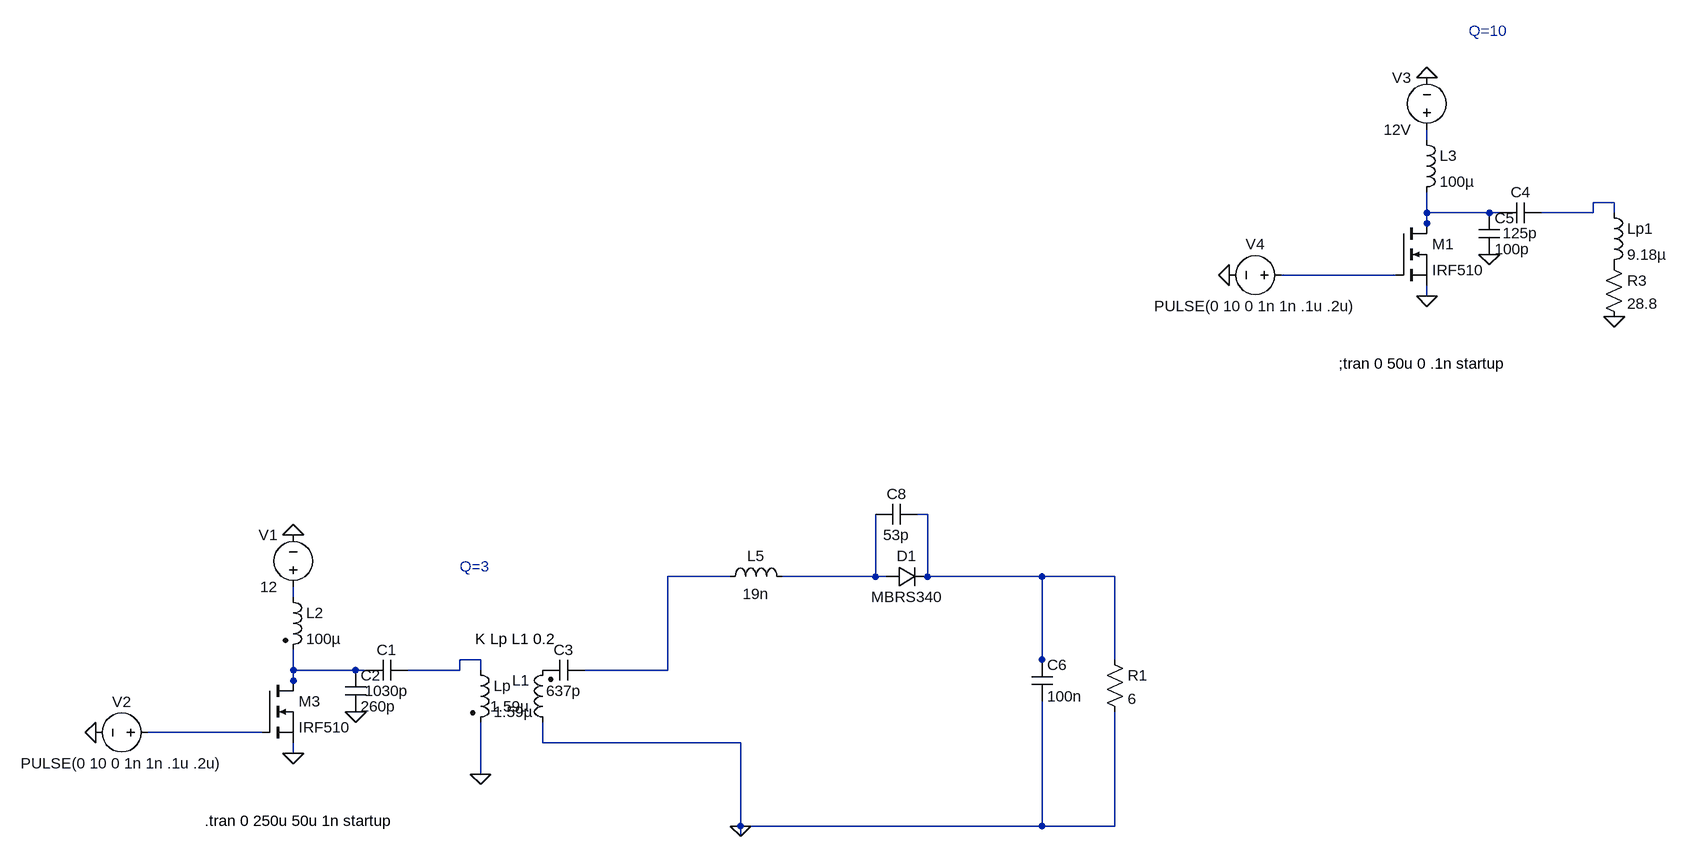
[diagram p0: schematic ClassE.asc]
ClassE.asc, the LTspice schematic file:
Version 4.1
SHEET 1 2296 692
WIRE 1920 -720 1920 -736
WIRE 2208 -624 2176 -624
WIRE 1920 -608 1920 -640
WIRE 2016 -608 1920 -608
WIRE 2032 -608 2016 -608
WIRE 2176 -608 2176 -624
WIRE 2176 -608 2096 -608
WIRE 2208 -608 2208 -624
WIRE 1920 -592 1920 -608
WIRE 1920 -576 1920 -592
WIRE 1872 -512 1696 -512
WIRE 1920 -480 1920 -496
WIRE 1152 -144 1136 -144
WIRE 848 -48 752 -48
WIRE 1072 -48 1072 -144
WIRE 1072 -48 928 -48
WIRE 1088 -48 1072 -48
WIRE 1152 -48 1152 -144
WIRE 1328 -48 1152 -48
WIRE 1440 -48 1328 -48
WIRE 176 -16 176 -32
WIRE 464 80 432 80
WIRE 1328 80 1328 -48
WIRE 1440 80 1440 -48
WIRE 176 96 176 64
WIRE 272 96 176 96
WIRE 288 96 272 96
WIRE 432 96 432 80
WIRE 432 96 352 96
WIRE 464 96 464 80
WIRE 752 96 752 -48
WIRE 752 96 624 96
WIRE 1328 96 1328 80
WIRE 176 112 176 96
WIRE 176 128 176 112
WIRE 128 192 -48 192
WIRE 560 208 560 176
WIRE 864 208 560 208
WIRE 176 224 176 208
WIRE 464 256 464 176
WIRE 864 336 864 208
WIRE 1328 336 1328 144
WIRE 1328 336 864 336
WIRE 1440 336 1440 160
WIRE 1440 336 1328 336
WIRE 864 352 864 336
FLAG -128 192 0
FLAG 272 160 0
FLAG 176 224 0
FLAG 464 256 0
FLAG 1920 -816 0
FLAG 1616 -512 0
FLAG 2016 -544 0
FLAG 1920 -480 0
FLAG 2208 -448 0
FLAG 176 -112 0
FLAG 864 336 0
SYMBOL cap 352 80 R90
WINDOW 0 0 32 VBottom 2
WINDOW 3 32 32 VTop 2
SYMATTR InstName C1
SYMATTR Value 1030p
SYMBOL cap 256 96 R0
SYMATTR InstName C2
SYMATTR Value 260p
SYMBOL ind2 160 -32 R0
SYMATTR InstName L2
SYMATTR Value 100µ
SYMATTR Type ind
SYMBOL voltage 176 -16 R180
WINDOW 0 24 96 Left 2
WINDOW 3 24 16 Left 2
SYMATTR InstName V1
SYMATTR Value 12
SYMBOL voltage -32 192 R90
WINDOW 0 -32 56 VBottom 2
WINDOW 3 32 56 VTop 2
WINDOW 123 0 0 Left 0
WINDOW 39 60 56 VTop 2
SYMATTR InstName V2
SYMATTR Value PULSE(0 10 0 1n 1n .1u .2u)
SYMBOL ind2 448 80 R0
SYMATTR InstName Lp
SYMATTR Value 1.59µ
SYMATTR Type ind
SYMBOL cap 2096 -624 R90
WINDOW 0 0 32 VBottom 2
WINDOW 3 32 32 VTop 2
SYMATTR InstName C4
SYMATTR Value 125p
SYMBOL cap 2000 -608 R0
SYMATTR InstName C5
SYMATTR Value 100p
SYMBOL ind 1904 -736 R0
SYMATTR InstName L3
SYMATTR Value 100µ
SYMBOL voltage 1920 -720 R180
WINDOW 0 24 96 Left 2
WINDOW 3 24 16 Left 2
SYMATTR InstName V3
SYMATTR Value 12V
SYMBOL voltage 1712 -512 R90
WINDOW 0 -32 56 VBottom 2
WINDOW 3 32 56 VTop 2
WINDOW 123 0 0 Left 0
WINDOW 39 60 56 VTop 2
SYMATTR InstName V4
SYMATTR Value PULSE(0 10 0 1n 1n .1u .2u)
SYMBOL ind 2192 -624 R0
SYMATTR InstName Lp1
SYMATTR Value 9.18µ
SYMBOL res 2192 -544 R0
SYMATTR InstName R3
SYMATTR Value 28.8
SYMBOL nmos 128 112 R0
SYMATTR InstName M3
SYMATTR Value IRF510
SYMBOL ind2 576 192 R180
WINDOW 0 36 80 Left 2
WINDOW 3 36 40 Left 2
SYMATTR InstName L1
SYMATTR Value 1.59µ
SYMATTR Type ind
SYMBOL cap 624 80 R90
WINDOW 0 0 32 VBottom 2
WINDOW 3 32 32 VTop 2
SYMATTR InstName C3
SYMATTR Value 637p
SYMBOL nmos 1872 -592 R0
SYMATTR InstName M1
SYMATTR Value IRF510
SYMBOL cap 1312 80 R0
SYMATTR InstName C6
SYMATTR Value 100n
SYMBOL res 1424 64 R0
SYMATTR InstName R1
SYMATTR Value 6
SYMBOL ind 832 -32 R270
WINDOW 0 32 56 VTop 2
WINDOW 3 5 56 VBottom 2
SYMATTR InstName L5
SYMATTR Value 19n
SYMBOL diode 1088 -32 R270
WINDOW 0 32 32 VTop 2
WINDOW 3 0 32 VBottom 2
SYMATTR InstName D1
SYMATTR Value MBRS340
SYMBOL cap 1136 -160 R90
WINDOW 0 0 32 VBottom 2
WINDOW 3 32 32 VTop 2
SYMATTR InstName C8
SYMATTR Value 53p
TEXT 40 328 Left 2 !.tran 0 250u 50u 1n startup
TEXT 1784 -376 Left 2 !;tran 0 50u 0 .1n startup
TEXT 456 48 Left 2 !K Lp L1 0.2
TEXT 432 -64 Left 2 ;Q=3
TEXT 1984 -888 Left 2 ;Q=10

The netlist it stands for:
* ClassE.asc
C1 N009 N010 1030p
C2 N010 0 260p
L2 N008 N010 100µ
V1 N008 0 12
V2 N011 0 PULSE(0 10 0 1n 1n .1u .2u)
Lp N009 0 1.59µ
C4 N002 N003 125p
C5 N003 0 100p
L3 N001 N003 100µ
V3 N001 0 12V
V4 N004 0 PULSE(0 10 0 1n 1n .1u .2u)
Lp1 N002 P001 9.18µ
R3 P001 0 28.8
M3 N010 N011 0 0 IRF510
L1 0 P002 1.59µ
C3 N006 P002 637p
M1 N003 N004 0 0 IRF510
C6 N005 0 100n
R1 N005 0 6
L5 N006 N007 19n
D1 N007 N005 MBRS340
C8 N005 N007 53p
.model D D
.lib standard.dio
.model NMOS NMOS
.model PMOS PMOS
.lib standard.mos
.tran 0 250u 50u 1n startup
;tran 0 50u 0 .1n startup
K Lp L1 0.2
* Q=3
* Q=10
.backanno
.end